# EAGLE schematic Main_Board (EAGLE 7.5.0)
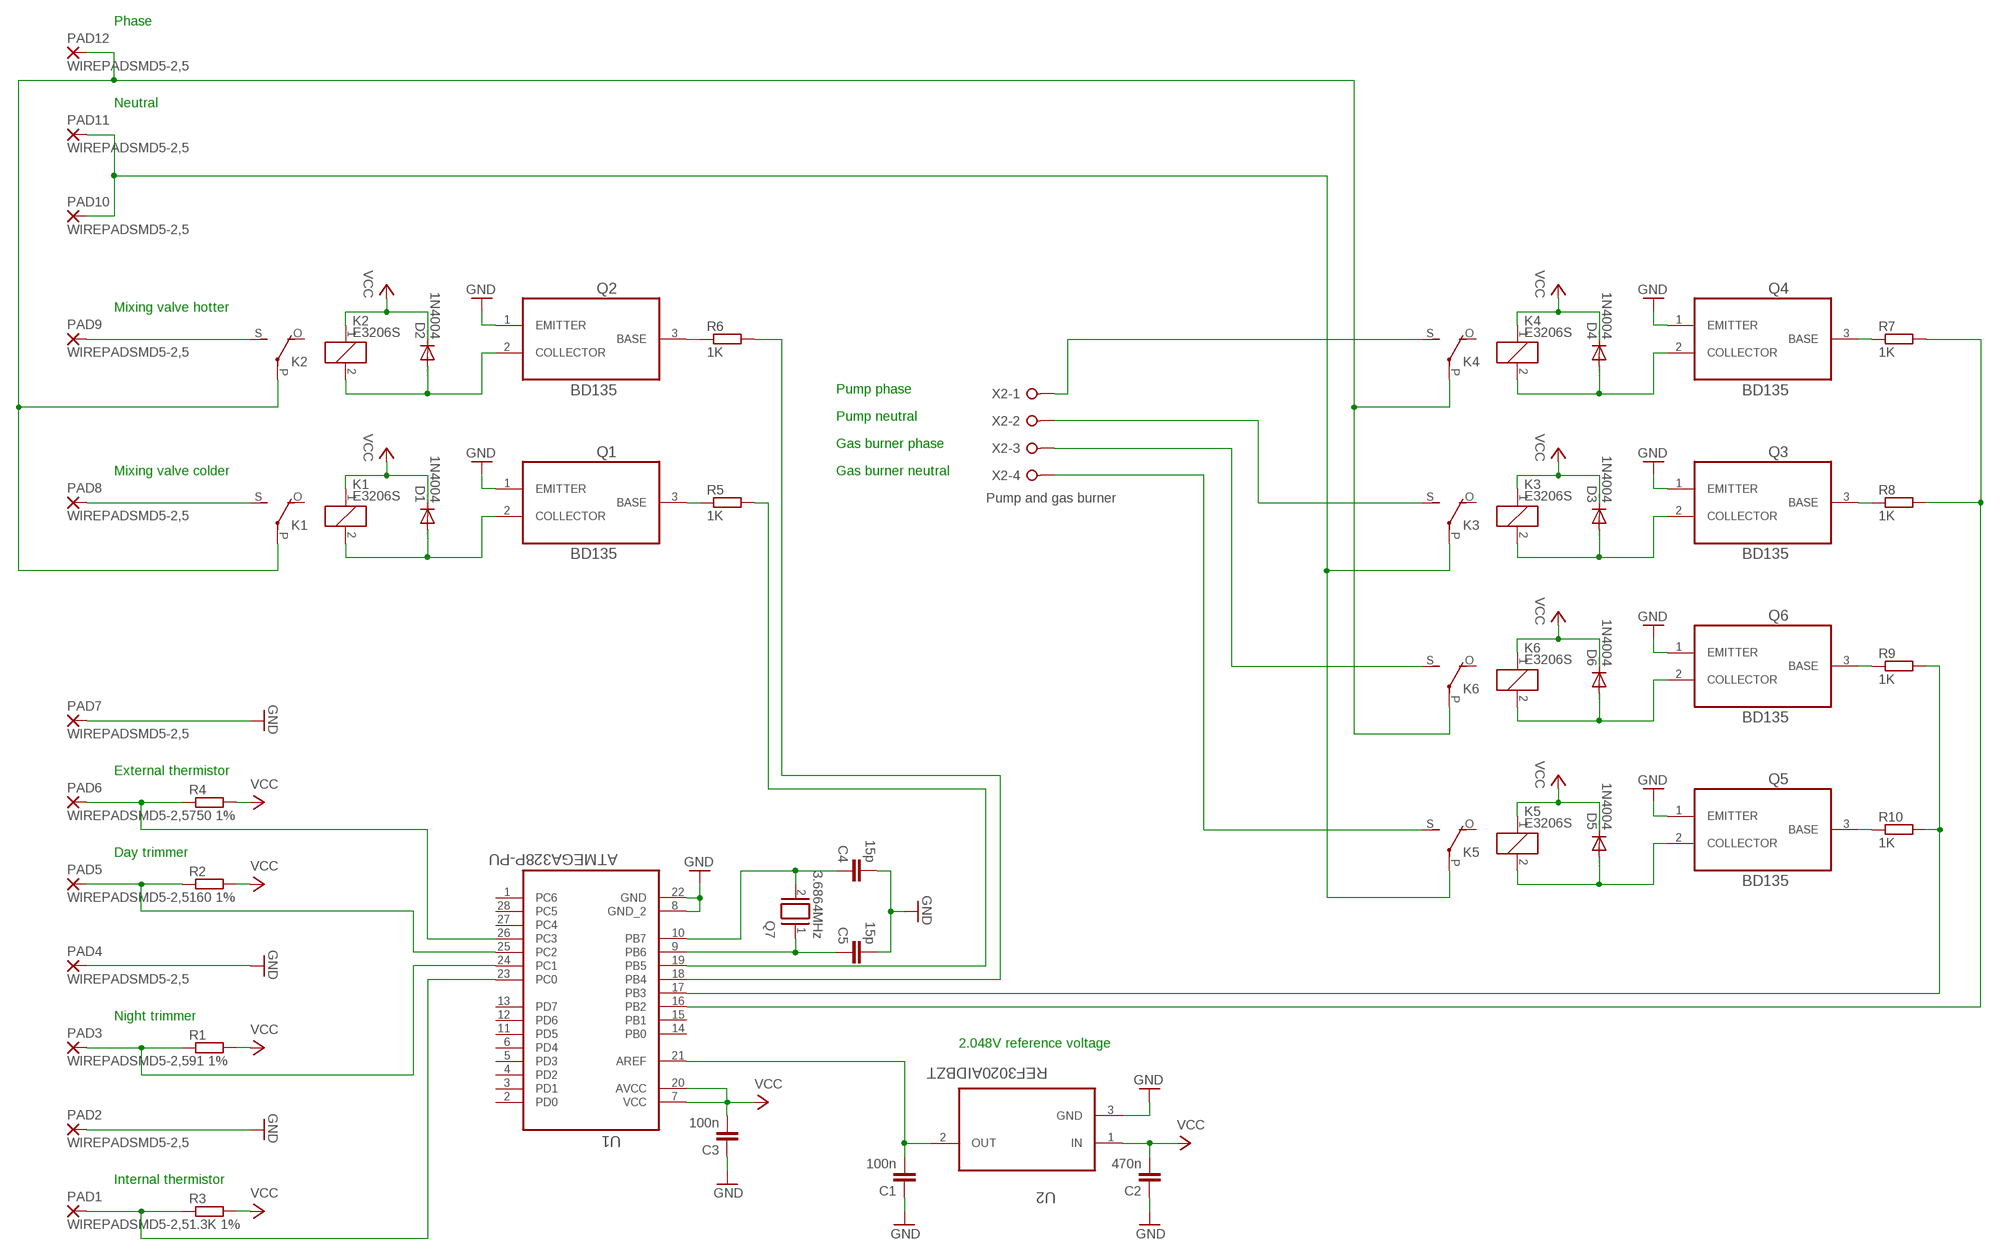
[diagram p0: schematic, sheet 1]

## Parts
C1  100n  C-EU050-035X075  [C050-035X075]
C2  470n  C-EU050-035X075  [C050-035X075]
C3  100n  C-EU050-035X075  [C050-035X075]
C4  15p  C-EU025-030X050  [C025-030X050]
C5  15p  C-EU025-030X050  [C025-030X050]
D1  1N4004  [DO41-10]
D2  1N4004  [DO41-10]
D3  1N4004  [DO41-10]
D4  1N4004  [DO41-10]
D5  1N4004  [DO41-10]
D6  1N4004  [DO41-10]
K1  E3206S  [E3206S]
K2  E3206S  [E3206S]
K3  E3206S  [E3206S]
K4  E3206S  [E3206S]
K5  E3206S  [E3206S]
K6  E3206S  [E3206S]
PAD1  WIREPADSMD5-2,5  [5-2,5]
PAD2  WIREPADSMD5-2,5  [5-2,5]
PAD3  WIREPADSMD5-2,5  [5-2,5]
PAD4  WIREPADSMD5-2,5  [5-2,5]
PAD5  WIREPADSMD5-2,5  [5-2,5]
PAD6  WIREPADSMD5-2,5  [5-2,5]
PAD7  WIREPADSMD5-2,5  [5-2,5]
PAD8  WIREPADSMD5-2,5  [5-2,5]
PAD9  WIREPADSMD5-2,5  [5-2,5]
PAD10  WIREPADSMD5-2,5  [5-2,5]
PAD11  WIREPADSMD5-2,5  [5-2,5]
PAD12  WIREPADSMD5-2,5  [5-2,5]
Q1  BD135  [TRANS_BD135]
Q2  BD135  [TRANS_BD135]
Q3  BD135  [TRANS_BD135]
Q4  BD135  [TRANS_BD135]
Q5  BD135  [TRANS_BD135]
Q6  BD135  [TRANS_BD135]
Q7  3.6864MHz  XTAL/S  [QS]
R1  91 1%  R-EU_0207/10  [0207/10]
R2  160 1%  R-EU_0207/10  [0207/10]
R3  1.3K 1%  R-EU_0207/10  [0207/10]
R4  750 1%  R-EU_0207/10  [0207/10]
R5  1K  R-EU_0207/10  [0207/10]
R6  1K  R-EU_0207/10  [0207/10]
R7  1K  R-EU_0207/10  [0207/10]
R8  1K  R-EU_0207/10  [0207/10]
R9  1K  R-EU_0207/10  [0207/10]
R10  1K  R-EU_0207/10  [0207/10]
U1  ATMEGA328P-PU  [DIP254P762X457-28]
U2  REF3020AIDBZT  [SOT95P237X112-3N]
X2  Pump and gas burner  W237-04P  [W237-4P]

## Nets
GND: C1.1 C2.1 C3.1 C4.2 C5.2 PAD2.1(P) PAD4.1(P) PAD7.1(P) Q1.1(EMITTER) Q2.1(EMITTER) Q3.1(EMITTER) Q4.1(EMITTER) Q5.1(EMITTER) Q6.1(EMITTER) U1.8(GND_2) U1.22(GND) U2.3(GND)
N$1: PAD5.1(P) R2.1 U1.25(PC2)
N$2: PAD1.1(P) R3.1 U1.23(PC0)
N$3: K1.S(2:S) PAD8.1(P)
N$4: D1.A K1.2 Q1.2(COLLECTOR)
N$5: Q4.3(BASE) R7.1
N$6: K2.S(2:S) PAD9.1(P)
N$7: D2.A K2.2 Q2.2(COLLECTOR)
N$8: PAD6.1(P) R4.1 U1.26(PC3)
N$9: Q1.3(BASE) R5.1
N$10: K1.P(2:P) K2.P(2:P) K4.P(2:P) K6.P(2:P) PAD12.1(P)
N$11: K5.S(2:S) X2.4
N$12: K3.S(2:S) X2.2
N$13: D3.A K3.2 Q3.2(COLLECTOR)
N$14: K4.S(2:S) X2.1
N$15: D4.A K4.2 Q4.2(COLLECTOR)
N$16: C1.2 U1.21(AREF) U2.2(OUT)
N$17: D5.A K5.2 Q5.2(COLLECTOR)
N$18: K6.S(2:S) X2.3
N$19: D6.A K6.2 Q6.2(COLLECTOR)
N$20: Q2.3(BASE) R6.1
N$21: R5.2 U1.19(PB5)
N$22: R6.2 U1.18(PB4)
N$23: R9.2 R10.2 U1.17(PB3)
N$24: Q5.3(BASE) R10.1
N$25: Q6.3(BASE) R9.1
N$26: R7.2 R8.2 U1.16(PB2)
N$27: C4.1 Q7.2 U1.10(PB7)
N$28: Q3.3(BASE) R8.1
N$29: C5.1 Q7.1 U1.9(PB6)
N$31: K3.P(2:P) K5.P(2:P) PAD10.1(P) PAD11.1(P)
PIN4: PAD3.1(P) R1.1 U1.24(PC1)
VCC: C2.2 C3.2 D1.C D2.C D3.C D4.C D5.C D6.C K1.1 K2.1 K3.1 K4.1 K5.1 K6.1 R1.2 R2.2 R3.2 R4.2 U1.7(VCC) U1.20(AVCC) U2.1(IN)
Unconnected: K1.O(2:O) K2.O(2:O) K3.O(2:O) K4.O(2:O) K5.O(2:O) K6.O(2:O) U1.1(PC6) U1.2(PD0) U1.3(PD1) U1.4(PD2) U1.5(PD3) U1.6(PD4) U1.11(PD5) U1.12(PD6) U1.13(PD7) U1.14(PB0) U1.15(PB1) U1.27(PC4) U1.28(PC5)

## Notes on the sheet
- Phase
- Neutral
- Mixing valve hotter
- Pump phase
- Pump neutral
- Gas burner phase
- Mixing valve colder | Gas burner neutral
- External thermistor
- Day trimmer
- Night trimmer
- 2.048V reference voltage
- Internal thermistor

## Library data of the parts
C1-C5 = rcl:C-EU: CAPACITOR, European symbol
D1-D6 = diode:1N4004: DIODE general purpose rectifier, 1 A
K1-K6 = relay:E3206S: RELAY 1 x switch, Eichhoff/distributor Schukat; OC_FARNELL: unknown; OC_NEWARK: unknown
PAD1-PAD12 = wirepad:WIREPAD: Wire PAD connect wire on PCB
Q1-Q6 = BD135:BD135: TRANSISTOR, NPN, TO-126; MPN: BD135; OC_FARNELL: 1574347; OC_NEWARK: 08N7620; PACKAGE: TO-126; SUPPLIER: MULTICOMP
Q7 = special:XTAL/S: CRYSTAL
R1-R10 = resistor:R-EU_: RESISTOR, European symbol
U1 = ATMEGA328P-PU:ATMEGA328P-PU: 8-bit Microcontroller with In-System Programmable Flash; MPN: ATMEGA328P-PU; OC_FARNELL: 1715487; OC_NEWARK: 68T2944; PACKAGE: PDIP-28; SUPPLIER: Atmel
U2 = REF3020AIDBZT:REF3020AIDBZT: CMOS VOLTAGE REFERENCE; MPN: REF3020AIDBZT; OC_FARNELL: 1470323; OC_NEWARK: 75C7415; PACKAGE: SOT-23-3; SUPPLIER: Texas Instruments
X2 = con-wago-508:W237-04P: WAGO SREW CLAMP; OC_FARNELL: unknown; OC_NEWARK: unknown